# EAGLE design RHB0032E.pac (EAGLE 9.6.2)
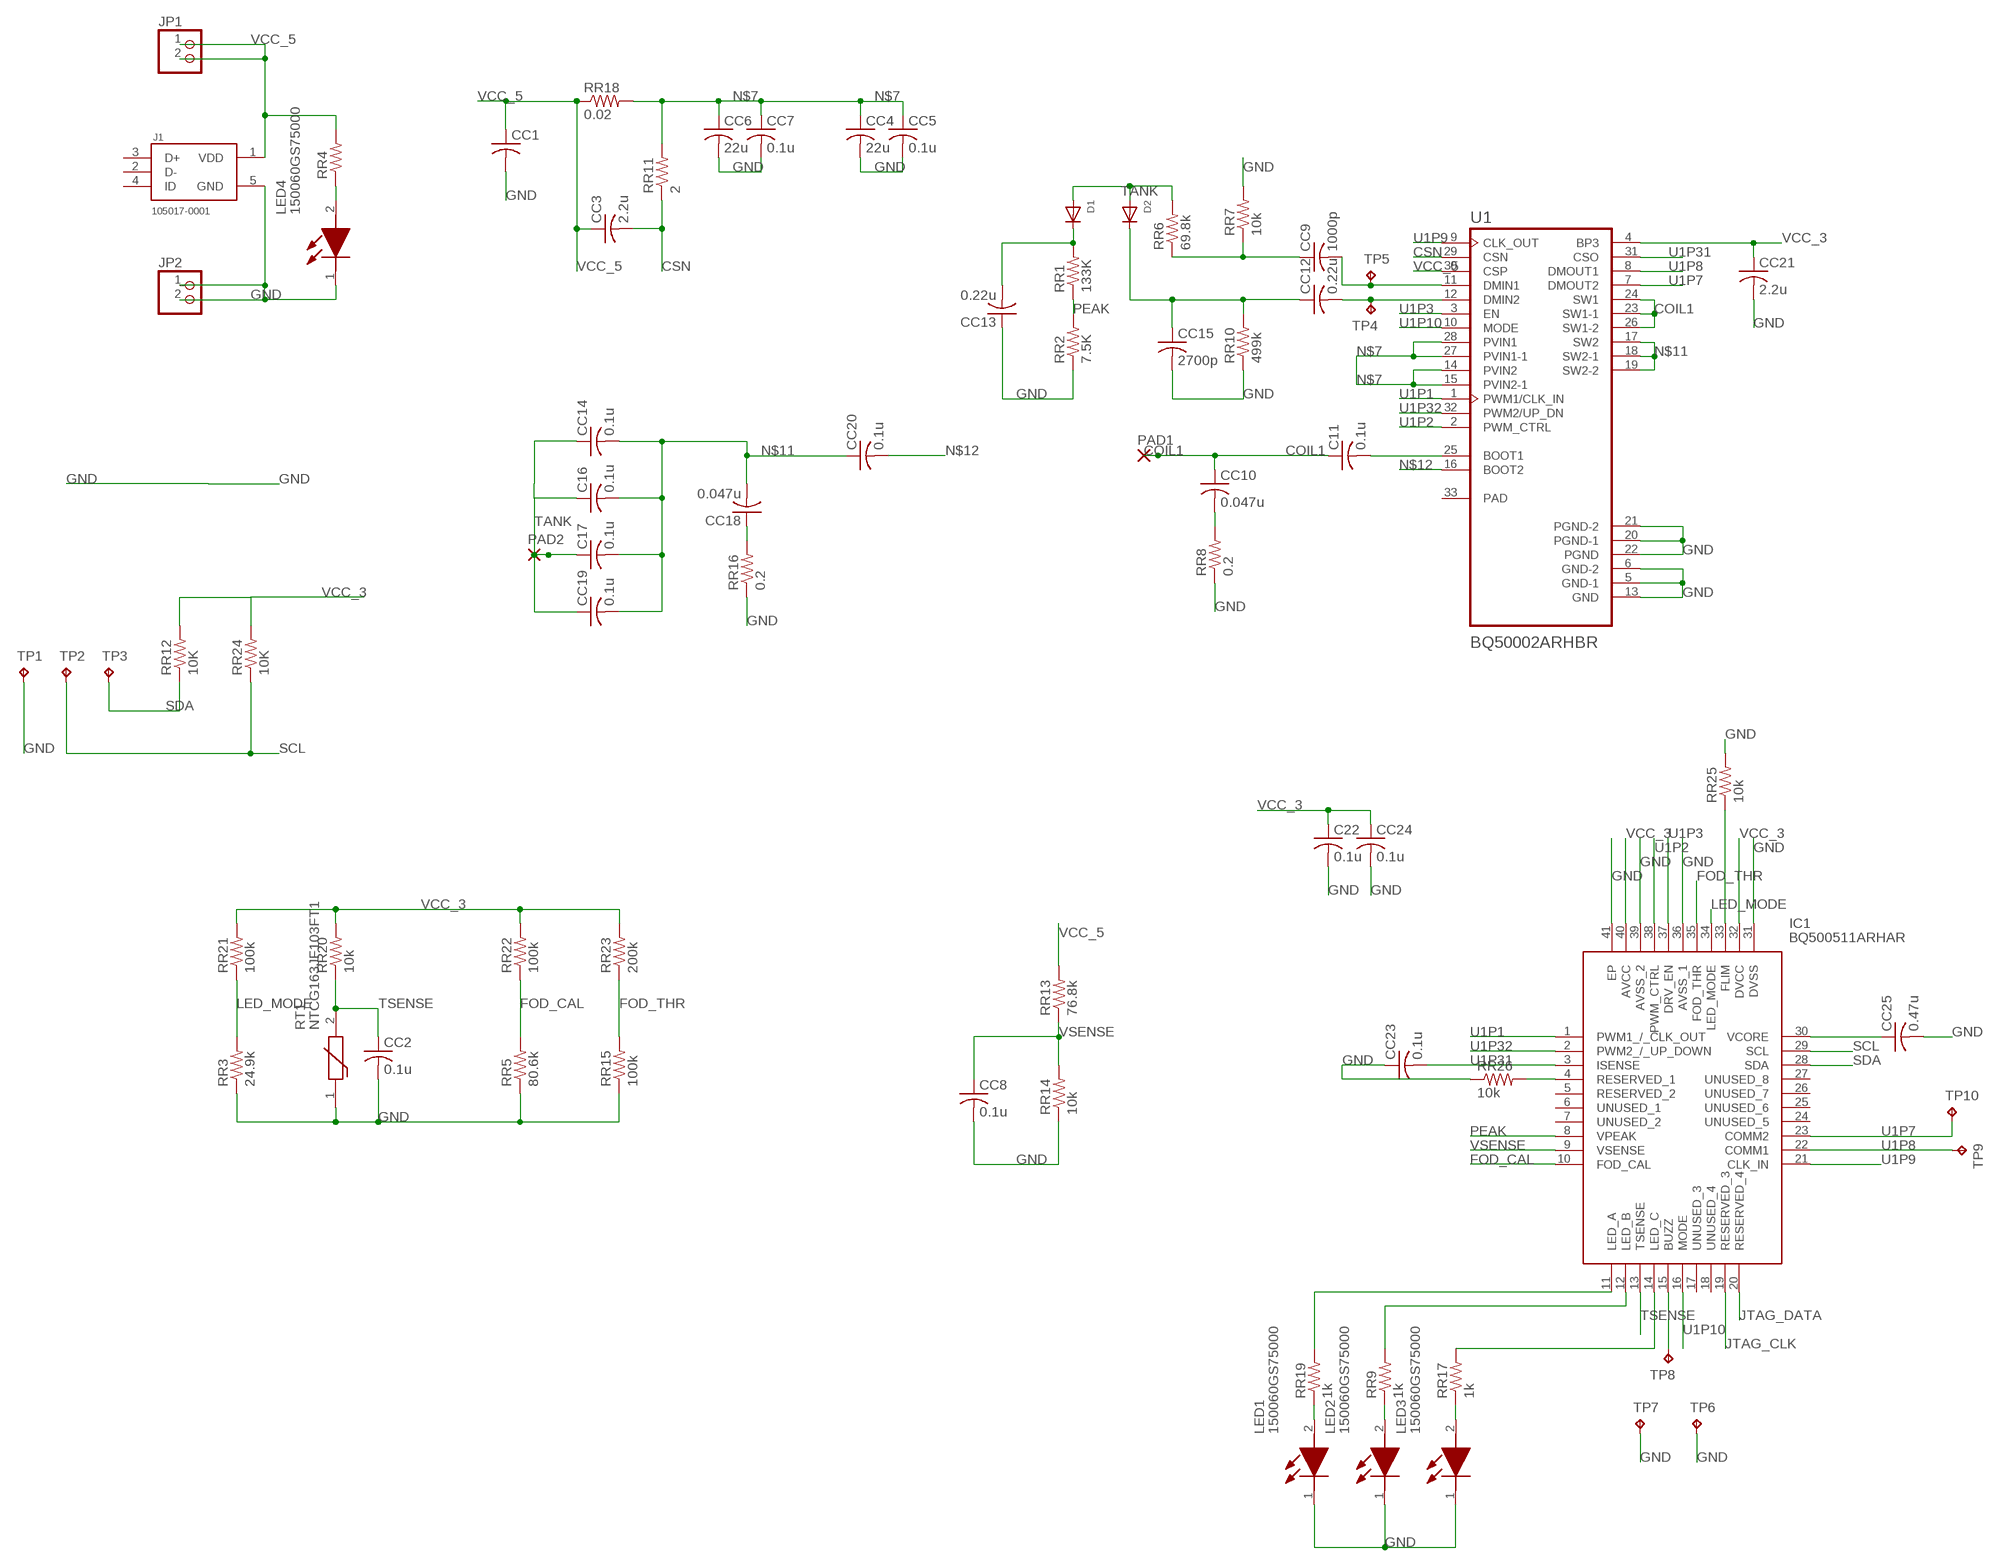
[diagram p0: schematic, sheet 1]

## Parts
C11  0.1u  C-USC0402  [C0402]
C16  0.1u  C-USC0402  [C0402]
C17  0.1u  C-USC0402  [C0402]
C22  0.1u  C-USC0402  [C0402]
CC1  C-USC0402  [C0402]
CC2  0.1u  C-USC0402  [C0402]
CC3  2.2u  C-USC0402  [C0402]
CC4  22u  C-USC0402  [C0402]
CC5  0.1u  C-USC0402  [C0402]
CC6  22u  C-USC0402  [C0402]
CC7  0.1u  C-USC0402  [C0402]
CC8  0.1u  C-USC0402  [C0402]
CC9  1000p  C-USC0402  [C0402]
CC10  0.047u  C-USC0402  [C0402]
CC12  0.22u  C-USC0402  [C0402]
CC13  0.22u  C-USC0402  [C0402]
CC14  0.1u  C-USC0402  [C0402]
CC15  2700p  C-USC0402  [C0402]
CC18  0.047u  C-USC0402  [C0402]
CC19  0.1u  C-USC0402  [C0402]
CC20  0.1u  C-USC0402  [C0402]
CC21  2.2u  C-USC0402  [C0402]
CC23  0.1u  C-USC0402  [C0402]
CC24  0.1u  C-USC0402  [C0402]
CC25  0.47u  C-USC0402  [C0402]
D1  DIODESOD-523  [SOD-523]
D2  DIODESOD-523  [SOD-523]
IC1  BQ500511ARHAR  [QFN50P600X600X100-41N]
J1  105017-0001  [MOLEX_105017-0001]
JP1  PINHD-1X2  [1X02]
JP2  PINHD-1X2  [1X02]
LED1  150060GS75000  [LEDC1608X80N]
LED2  150060GS75000  [LEDC1608X80N]
LED3  150060GS75000  [LEDC1608X80N]
LED4  150060GS75000  [LEDC1608X80N]
PAD1  SMD2  [SMD1,27-2,54]
PAD2  SMD2  [SMD1,27-2,54]
RR1  133K  R-US_R0603  [R0603]
RR2  7.5K  R-US_R0603  [R0603]
RR3  24.9k  R-US_R0603  [R0603]
RR4  R-US_R0603  [R0603]
RR5  80.6k  R-US_R0603  [R0603]
RR6  69.8k  R-US_R0603  [R0603]
RR7  10k  R-US_R0603  [R0603]
RR8  0.2  R-US_R0603  [R0603]
RR9  1k  R-US_R0603  [R0603]
RR10  499k  R-US_R0603  [R0603]
RR11  2  R-US_R0603  [R0603]
RR12  10K  R-US_R0603  [R0603]
RR13  76.8k  R-US_R0603  [R0603]
RR14  10k  R-US_R0603  [R0603]
RR15  100k  R-US_R0603  [R0603]
RR16  0.2  R-US_R0603  [R0603]
RR17  1k  R-US_R0603  [R0603]
RR18  0.02  R-US_R0603  [R0603]
RR19  1k  R-US_R0603  [R0603]
RR20  10k  R-US_R0603  [R0603]
RR21  100k  R-US_R0603  [R0603]
RR22  100k  R-US_R0603  [R0603]
RR23  200k  R-US_R0603  [R0603]
RR24  10K  R-US_R0603  [R0603]
RR25  10k  R-US_R0603  [R0603]
RR26  10k  R-US_R0603  [R0603]
RT1  NTCG163JF103FT1  [THRMC1608X90N]
TP1  TPB1,27  [B1,27]
TP2  TPB1,27  [B1,27]
TP3  TPB1,27  [B1,27]
TP4  TPB1,27  [B1,27]
TP5  TPB1,27  [B1,27]
TP6  TPB1,27  [B1,27]
TP7  TPB1,27  [B1,27]
TP8  TPB1,27  [B1,27]
TP9  TPB1,27  [B1,27]
TP10  TPB1,27  [B1,27]
U1  BQ50002ARHBR  [IC_ADS125H01IRHBT]

## Nets
COIL1: C11.1 CC10.1 PAD1.1(P) U1.23(SW1-1) U1.24(SW1) U1.26(SW1-2)
CSN: CC3.2 RR11.1 U1.29(CSN)
FOD_CAL: IC1.10(FOD_CAL) RR5.2 RR22.1
FOD_THR: IC1.35(FOD_THR) RR15.2 RR23.1
GND: C22.2 CC1.2 CC2.2 CC4.2 CC5.2 CC6.2 CC7.2 CC8.2 CC13.1 CC15.2 CC21.2 CC23.1 CC24.2 CC25.2 IC1.31(DVSS) IC1.36(AVSS_1) IC1.39(AVSS_2) IC1.41(EP) J1.5(GND) JP2.1 JP2.2 LED1.1(K) LED2.1(K) LED3.1(K) LED4.1(K) RR2.1 RR3.1 RR5.1 RR7.2 RR8.1 RR10.1 RR14.1 RR15.1 RR16.1 RR25.2 RR26.1 RT1.1 TP1.TP TP6.TP TP7.TP U1.5(GND-1) U1.6(GND-2) U1.13(GND) U1.20(PGND-1) U1.21(PGND-2) U1.22(PGND)
JTAG_CLK: IC1.19(RESERVED_3)
JTAG_DATA: IC1.20(RESERVED_4)
LED_MODE: IC1.34(LED_MODE) RR3.2 RR21.1
N$1: CC12.2 TP4.TP U1.12(DMIN2)
N$2: CC12.1 CC15.1 D2.K(C) RR10.2
N$4: CC13.2 D1.K(C) RR1.2
N$5: CC9.2 TP5.TP U1.11(DMIN1)
N$6: CC9.1 RR6.1 RR7.1
N$7: CC4.1 CC5.1 CC6.1 CC7.1 RR11.2 RR18.2 U1.14(PVIN2) U1.15(PVIN2-1) U1.27(PVIN1-1) U1.28(PVIN1)
N$8: IC1.15(BUZZ) TP8.TP
N$9: C11.2 U1.25(BOOT1)
N$10: CC10.2 RR8.2
N$11: C16.2 C17.2 CC14.2 CC18.2 CC19.2 CC20.1 U1.17(SW2) U1.18(SW2-1) U1.19(SW2-2)
N$12: CC20.2 U1.16(BOOT2)
N$13: CC25.1 IC1.30(VCORE)
N$14: LED1.2(A) RR19.1
N$15: CC18.1 RR16.2
N$16: LED2.2(A) RR9.1
N$17: LED3.2(A) RR17.1
N$18: IC1.33(FLIM) RR25.1
N$19: IC1.11(LED_A) RR19.2
N$20: IC1.12(LED_B) RR9.2
N$21: IC1.14(LED_C) RR17.2
N$22: IC1.4(RESERVED_1) RR26.2
N$23: LED4.2(A) RR4.1
PEAK: IC1.8(VPEAK) RR1.1 RR2.2
SCL: IC1.29(SCL) RR24.1 TP2.TP
SDA: IC1.28(SDA) RR12.1 TP3.TP
TANK: C16.1 C17.1 CC14.1 CC19.1 D1.A D2.A PAD2.1(P) RR6.2
TSENSE: CC2.1 IC1.13(TSENSE) RR20.1 RT1.2
U1P1: IC1.1(PWM1_/_CLK_OUT) U1.1(PWM1/CLK_IN)
U1P2: IC1.38(PWM_CTRL) U1.2(PWM_CTRL)
U1P3: IC1.37(DRV_EN) U1.3(EN)
U1P7: IC1.23(COMM2) TP10.TP U1.7(DMOUT2)
U1P8: IC1.22(COMM1) TP9.TP U1.8(DMOUT1)
U1P9: IC1.21(CLK_IN) U1.9(CLK_OUT)
U1P10: IC1.16(MODE) U1.10(MODE)
U1P31: CC23.2 IC1.3(ISENSE) U1.31(CSO)
U1P32: IC1.2(PWM2_/_UP_DOWN) U1.32(PWM2/UP_DN)
VCC_3: C22.1 CC21.1 CC24.1 IC1.32(DVCC) IC1.40(AVCC) RR12.2 RR20.2 RR21.2 RR22.2 RR23.2 RR24.2 U1.4(BP3)
VCC_5: CC1.1 CC3.1 J1.1(VDD) JP1.1 JP1.2 RR4.2 RR13.2 RR18.1 U1.30(CSP)
VSENSE: CC8.1 IC1.9(VSENSE) RR13.1 RR14.2
Unconnected: IC1.5(RESERVED_2) IC1.6(UNUSED_1) IC1.7(UNUSED_2) IC1.17(UNUSED_3) IC1.18(UNUSED_4) IC1.24(UNUSED_5) IC1.25(UNUSED_6) IC1.26(UNUSED_7) IC1.27(UNUSED_8) J1.2(D-) J1.3(D+) J1.4(ID) U1.33(PAD)

## Library data of the parts
C11 C16 C17 C22 CC1-CC10 CC12-CC15 CC18-CC21 CC23-CC25 = adafruit:C-US: CAPACITOR, American symbol
D1 D2 = adafruit:DIODE: Diode SMADIODE - SMA Surface Mount Package 20V 1A Schottky Diode Digikey: 641-1014-6-ND DO-1N4148 - Through Hole Small Current Diode SOD-123 20V 1 A (.5mV Vf) Schottky Diode - Digikey: MBRX120TPMSCT-ND SOD-323 10V 570mA (.38mV Vf, 3ns) Schottky Diode - Digikey: ZLLS410CT-ND SOD-523 30V 30mA Schottky Diode (RB751S-40TE61) - Digikey: RB751S-40TE61CT-ND SOT23-R/W - SOT23 Package (R = Solder Paste/Reflow Ovens, W = Hand-Soldering) BAT54Film 40V 300mA - Digikey: 497-7162-1-ND
IC1 = BQ500511ARHAR:BQ500511ARHAR: Wireless Charging ICs Wireless Power Transmitter Controller 40-VQFN -40 to 85 Source: Datasheet <http://www.ti.com/lit/ds/symlink/bq500511a.pdf>; DESCRIPTION: Wireless Charging ICs Wireless Power Transmitter Controller 40-VQFN -40 to 85; HEIGHT: 1mm; MANUFACTURER_NAME: Texas Instruments; MANUFACTURER_PART_NUMBER: BQ500511ARHAR; MOUSER_PART_NUMBER: 595-BQ500511ARHAR; MOUSER_PRICE-STOCK: https://www.mouser.co.uk/ProductDetail/Texas-Instruments/BQ500511ARHAR?qs=LuYMPh7GGMTHLnf6Ooavlw%3D%3D
J1 = 105017-0001:105017-0001: Check availability <https://pricing.snapeda.com/parts/105017-0001/Molex/view-part?ref=eda>; AVAILABILITY: In Stock; DESCRIPTION: USB - micro B USB 2.0 Receptacle Connector 5 Position Surface Mount, Right Angle; Through Hole; MF: Molex; MP: 105017-0001; PACKAGE: None; PRICE: None; PURCHASE-URL: https://pricing.snapeda.com/search/part/105017-0001/?ref=eda
JP1 JP2 = pinhead:PINHD-1X2: PIN HEADER
LED1-LED4 = 150060GS75000:150060GS75000: Wurth Elektronik WL-SMCW 520 nm Green LED, 1608 (0603) Clear SMD package Source: Datasheet <https://componentsearchengine.com/Datasheets/2/150060GS75000.pdf>; DESCRIPTION: Wurth Elektronik WL-SMCW 520 nm Green LED, 1608 (0603) Clear SMD package; HEIGHT: 0.8mm; MANUFACTURER_NAME: Wurth Elektronik; MANUFACTURER_PART_NUMBER: 150060GS75000; MOUSER_PART_NUMBER: 710-150060GS75000; MOUSER_PRICE-STOCK: https://www.mouser.co.uk/ProductDetail/Wurth-Elektronik/150060GS75000?qs=LlUlMxKIyB0UYkq5lDO8nA%3D%3D
PAD1 PAD2 = wirepad:SMD2: SMD PAD
RR1-RR26 = adafruit:R-US_: RESISTOR, American symbol
RT1 = NTCG163JF103FT1:NTCG163JF103FT1: Chip NTC Thermistors (Sensor), Resistance (at 25?C)=10k?, Resistance Tolerance (at 25?C)=?1% Source: Datasheet <https://product.tdk.com/system/files/dam/doc/product/sensor/ntc/chip-ntc-thermistor/catalog/tpd_commercial_ntc-thermistor_ntcg_en.pdf>; DESCRIPTION: Chip NTC Thermistors (Sensor), Resistance (at 25?C)=10k?, Resistance Tolerance (at 25?C)=?1%; HEIGHT: 0.9mm; MANUFACTURER_NAME: TDK; MANUFACTURER_PART_NUMBER: NTCG163JF103FT1; MOUSER_PART_NUMBER: 810-NTCG163JF103FT1; MOUSER_PRICE-STOCK: https://www.mouser.co.uk/ProductDetail/TDK/NTCG163JF103FT1?qs=f0gCvUGw%252BIyUP%2FT8hD9VGA%3D%3D
TP1-TP10 = testpad:TP: Test pad
U1 = BQ50002ARHBR:BQ50002ARHBR: Check availability <https://pricing.snapeda.com/parts/BQ50002ARHBR/Texas%20Instruments/view-part?ref=eda>; AVAILABILITY: In Stock; DESCRIPTION: Low-Cost 5-V Wireless Power Transmitter AFE WPC V 1.2 A11 Transmitter 32-VQFN -40 to 125; MF: Texas Instruments; MP: BQ50002ARHBR; PACKAGE: VQFN-32 Texas Instruments; PRICE: None; PURCHASE-URL: https://pricing.snapeda.com/search/part/BQ50002ARHBR/?ref=eda

## Board
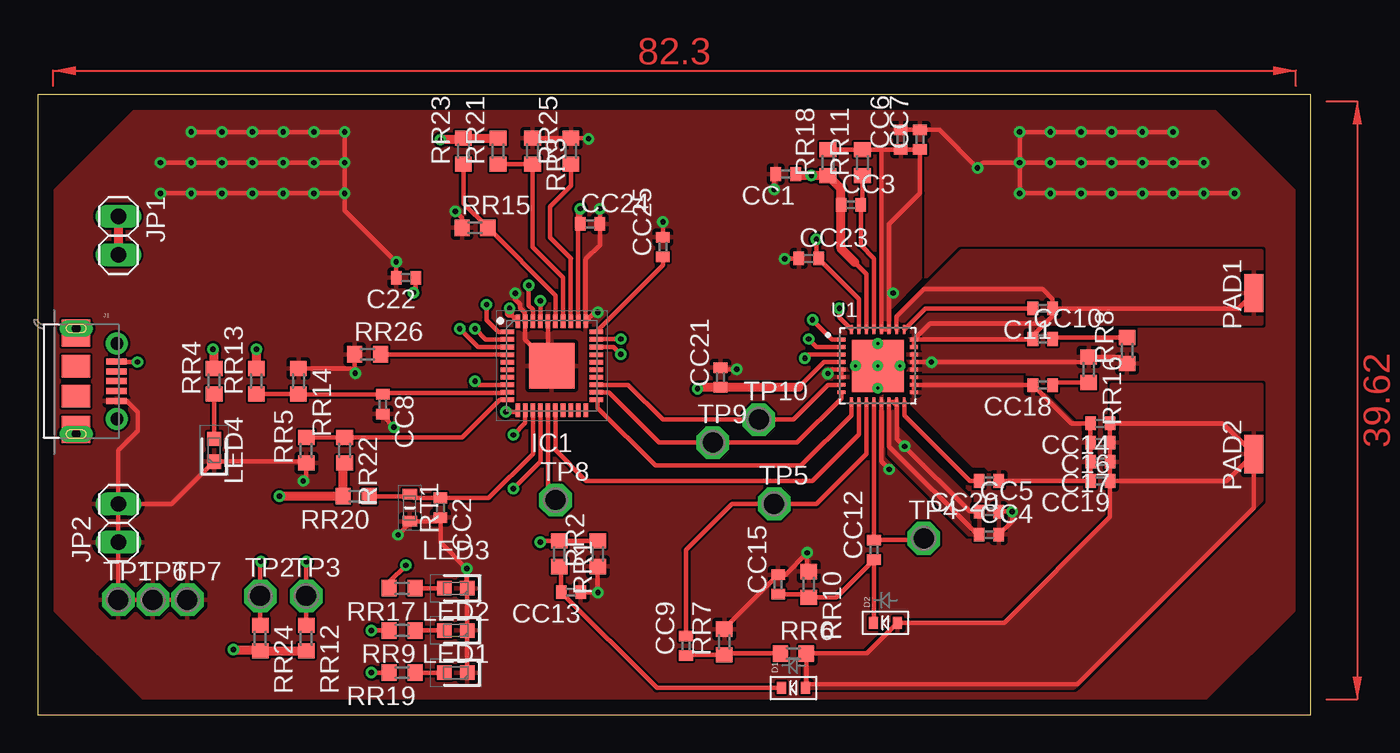
[diagram p1: board, top side]
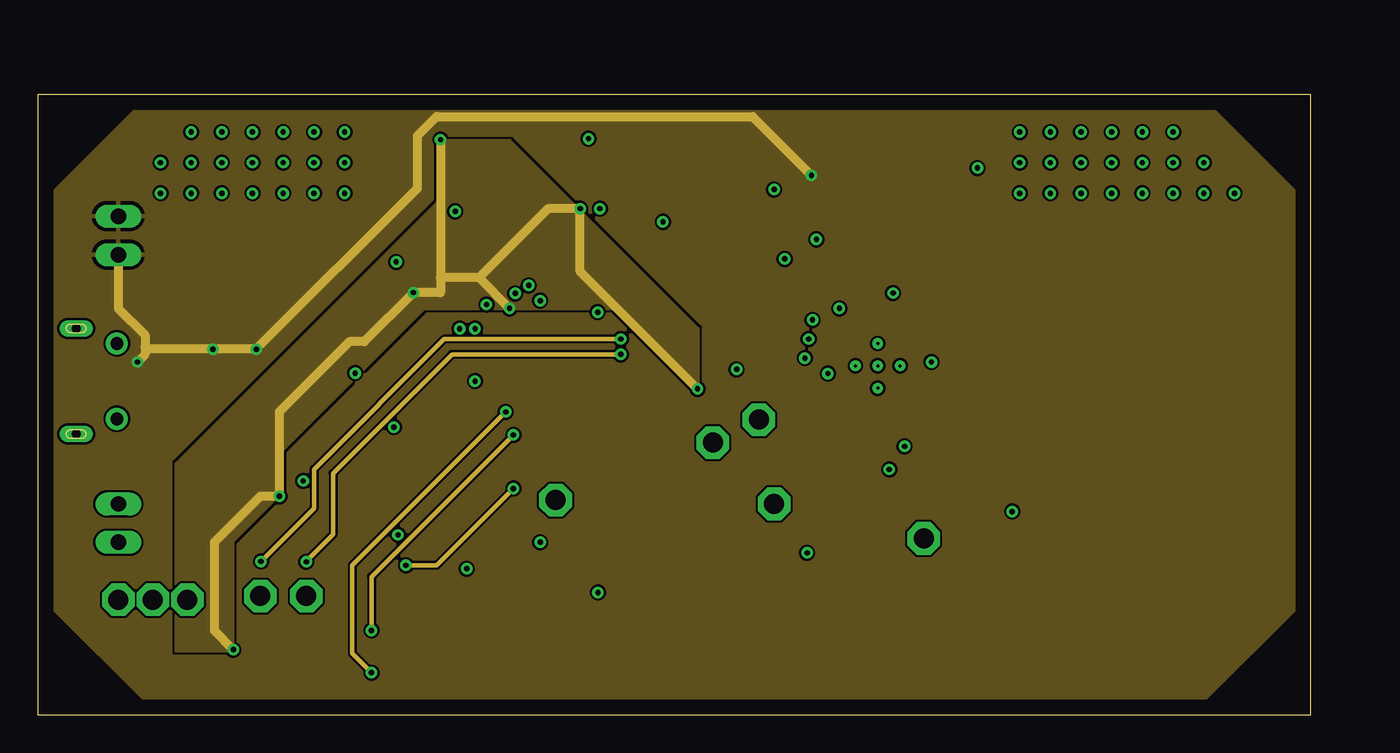
[diagram p2: board, inner layer Route2]
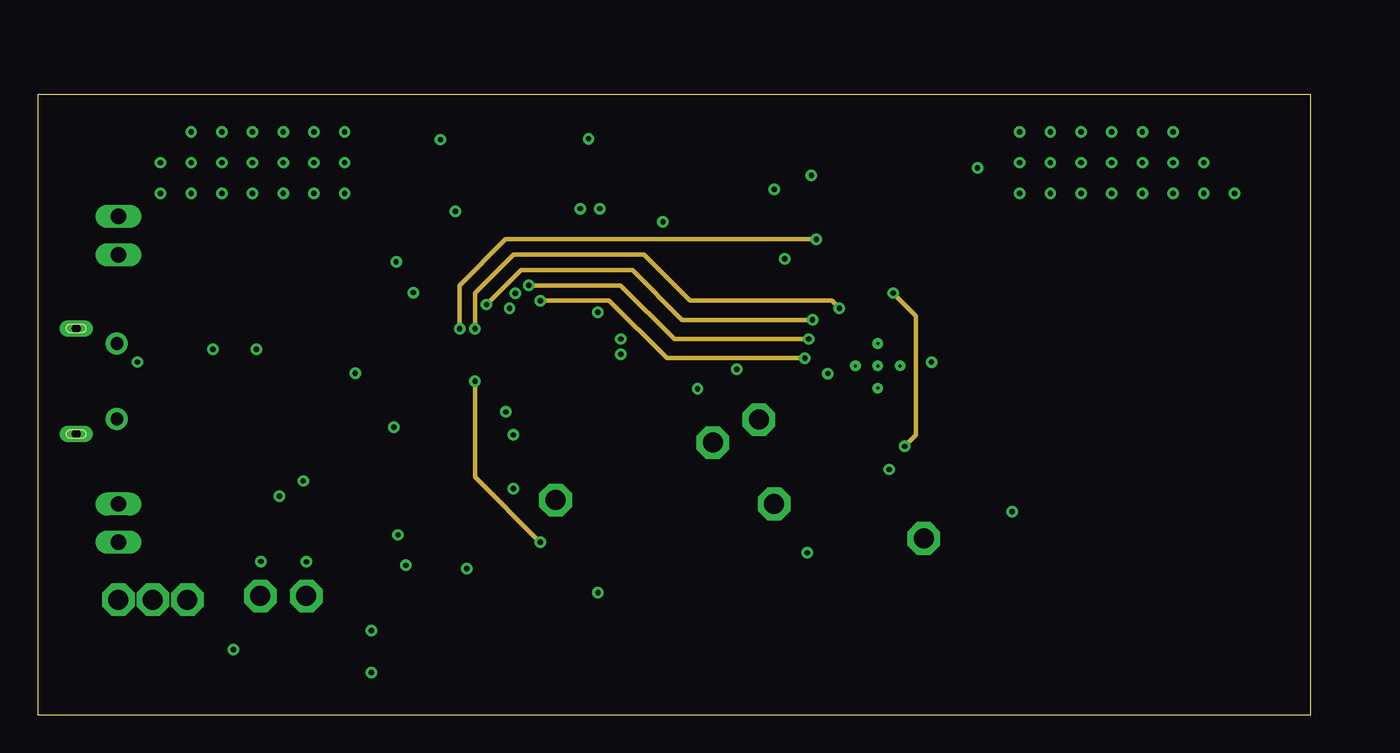
[diagram p3: board, inner layer Route15]
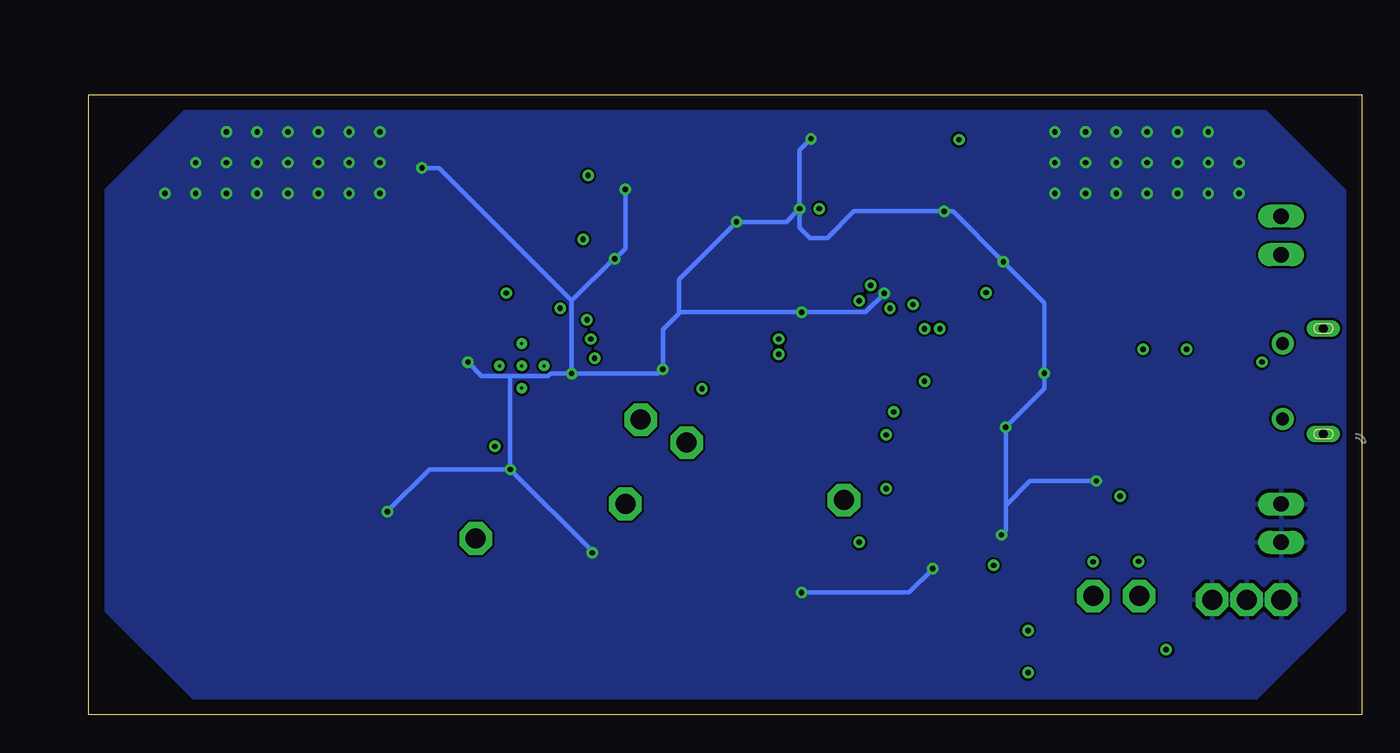
[diagram p4: board, bottom side, seen from below]

Size 84.31 x 41.07 mm. Coordinates in mm from the lower left corner, seen from the top.
Outline: 0,0 84.31,0 84.31,41.07 0,41.07 0,0
Copper layers (1+2*15+16): Top 0.035mm / dielectric 1.5mm / Route2 0.035mm / dielectric 0.15mm / Route15 0.035mm / dielectric 0.2mm / Bottom 0.035mm
Design rules "default *": minimum track width 6mil, minimum drill 0.35mm, track to track 6mil, track to pad 6mil, pad to pad 6mil, via to via 6mil, smd to smd 6mil, copper to edge 40mil, drill to drill 6mil, minimum pad ring 10mil, minimum via ring 8mil, stop-mask expansion 4mil, vias tented up to drill 0mil, thermal gap 10mil

### Footprints (pad centres in the part's own frame; a part is rotated, then mirrored left to right if it is on the bottom)
C0402 = smd 0.7 x 0.9: 1 -0.65,0; 2 0.65,0
SOD-523 = smd 0.8 x 0.6: A 0,-0.8; K 0,0.8
QFN50P600X600X100-41N = smd 0.9 x 0.3: 1 -2.95,2.25; 2 -2.95,1.75; 3 -2.95,1.25; 4 -2.95,0.75; 5 -2.95,0.25; 6 -2.95,-0.25; 7 -2.95,-0.75; 8 -2.95,-1.25; 9 -2.95,-1.75; 10 -2.95,-2.25; 21 2.95,-2.25; 22 2.95,-1.75; 23 2.95,-1.25; 24 2.95,-0.75; 25 2.95,-0.25; 26 2.95,0.25; 27 2.95,0.75; 28 2.95,1.25; 29 2.95,1.75; 30 2.95,2.25 | smd 0.3 x 0.9: 11 -2.25,-2.95; 12 -1.75,-2.95; 13 -1.25,-2.95; 14 -0.75,-2.95; 15 -0.25,-2.95; 16 0.25,-2.95; 17 0.75,-2.95; 18 1.25,-2.95; 19 1.75,-2.95; 20 2.25,-2.95; 31 2.25,2.95; 32 1.75,2.95; 33 1.25,2.95; 34 0.75,2.95; 35 0.25,2.95; 36 -0.25,2.95; 37 -0.75,2.95; 38 -1.25,2.95; 39 -1.75,2.95; 40 -2.25,2.95 | smd 3 x 3: 41 0,0
MOLEX_105017-0001 = smd 0.4 x 1.35: 1 -1.3,2.675; 2 -0.65,2.675; 3 0,2.675; 4 0.65,2.675; 5 1.3,2.675 | drill 0.85 pad 1.45: P$1 -2.5,2.7; P$2 2.5,2.7 | smd 1.5 x 1.9: P$8 -1,0; P$9 1,0 | smd 1.8 x 1.9: P$10 -3.2,0; P$11 3.2,0 | drill 0.6 pad 0.8 long: P$12 -3.5,0; P$13 3.5,0
1X02 = drill 1.016 long: 1 -1.27,0; 2 1.27,0
LEDC1608X80N = smd 0.95 x 0.95: 1 -0.75,0; 2 0.75,0
SMD1,27-2,54 = smd 1.27 x 2.54: 1 0,0
R0603 = smd 1 x 1.1: 1 -0.85,0; 2 0.85,0
THRMC1608X90N = smd 0.7 x 0.95: 1 -0.9,0; 2 0.9,0
P1-13 = drill 1.321 pad 2.159 octagon: TP 0,0
IC_ADS125H01IRHBT = smd 0.6 x 0.25: 1 -2.4,1.75; 2 -2.4,1.25; 3 -2.4,0.75; 4 -2.4,0.25; 5 -2.4,-0.25; 6 -2.4,-0.75; 7 -2.4,-1.25; 8 -2.4,-1.75; 17 2.4,-1.75; 18 2.4,-1.25; 19 2.4,-0.75; 20 2.4,-0.25; 21 2.4,0.25; 22 2.4,0.75; 23 2.4,1.25; 24 2.4,1.75 | smd 0.25 x 0.6: 9 -1.75,-2.4; 10 -1.25,-2.4; 11 -0.75,-2.4; 12 -0.25,-2.4; 13 0.25,-2.4; 14 0.75,-2.4; 15 1.25,-2.4; 16 1.75,-2.4; 25 1.75,2.4; 26 1.25,2.4; 27 0.75,2.4; 28 0.25,2.4; 29 -0.25,2.4; 30 -0.75,2.4; 31 -1.25,2.4; 32 -1.75,2.4 | smd 3.45 x 3.45: 33 0,0 | drill 0.2 pad 0.4: 34 0,0; 35 0,1.475; 36 -1.475,0; 37 0,-1.475; 38 1.475,0

### Placement (x,y rotation side)
C11  66.55,26.92 180 top
C16  70.36,18.03 180 top
C17  70.36,16.76 180 top
C22  24.38,28.96 180 top
CC1  49.53,35.81 180 top
CC2  26.67,13.72 270 top
CC3  53.85,33.78 0 top
CC4  62.99,11.94 0 top
CC5  62.99,13.46 0 top
CC6  57.15,38.1 90 top
CC7  58.42,38.1 90 top
CC8  22.86,20.57 270 top
CC9  42.93,4.57 90 top
CC10  66.55,24.89 0 top
CC12  55.37,10.92 90 top
CC13  35.31,8.13 180 top
CC14  70.36,19.3 180 top
CC15  49.02,8.64 90 top
CC18  66.55,21.84 180 top
CC19  70.36,15.49 180 top
CC20  62.99,15.49 180 top
CC21  45.21,22.35 90 top
CC23  51.05,30.23 0 top
CC24  36.58,32.51 0 top
CC25  41.4,30.99 90 top
D1  50.04,1.78 90 top
D2  56.13,6.1 90 top
IC1  34.04,23.11 0 top
J1  2.54,22.1 270 top
JP1  5.33,31.75 270 top
JP2  5.33,12.7 90 top
LED1  27.69,2.79 180 top
LED2  27.69,5.59 180 top
LED3  27.69,8.38 180 top
LED4  11.68,17.53 90 top
PAD1  80.52,27.94 0 top
PAD2  80.52,17.27 0 top
RR1  34.54,10.67 270 top
RR2  37.08,10.67 90 top
RR3  32.77,37.34 270 top
RR4  11.68,22.1 90 top
RR5  17.78,17.53 90 top
RR6  50.04,4.06 0 top
RR7  45.47,4.83 90 top
RR8  72.14,24.13 90 top
RR9  24.13,5.59 180 top
RR10  51.05,8.64 270 top
RR11  54.61,36.58 90 top
RR12  17.78,5.08 270 top
RR13  14.48,22.1 90 top
RR14  17.27,22.1 270 top
RR15  28.96,32.26 0 top
RR16  69.6,22.86 270 top
RR17  24.13,8.38 180 top
RR18  52.32,36.58 90 top
RR19  24.13,2.79 180 top
RR20  21.08,14.48 180 top
RR21  30.48,37.34 90 top
RR22  20.32,17.53 270 top
RR23  28.19,37.34 90 top
RR24  14.73,5.08 270 top
RR25  35.31,37.34 90 top
RR26  21.84,23.88 0 top
RT1  24.64,13.72 90 top
TP1  TPPAD1-13  [P1-13]  5.33,7.62 0 top
TP2  TPPAD1-13  [P1-13]  14.73,7.87 0 top
TP3  TPPAD1-13  [P1-13]  17.78,7.87 0 top
TP4  TPPAD1-13  [P1-13]  58.67,11.68 0 top
TP5  TPPAD1-13  [P1-13]  48.77,13.97 0 top
TP6  TPPAD1-13  [P1-13]  7.62,7.62 0 top
TP7  TPPAD1-13  [P1-13]  9.91,7.62 0 top
TP8  TPPAD1-13  [P1-13]  34.29,14.22 0 top
TP9  TPPAD1-13  [P1-13]  44.7,18.03 0 top
TP10  TPPAD1-13  [P1-13]  47.75,19.56 0 top
U1  55.63,23.11 0 top

### Tracks (layer width: path | path; a pad name or v marks a point on that pad's centre or on a via)
COIL1
  Top 0.305: U1.23 U1.24 | U1.24 65.87,24.86 CC10.1 65.9,25.12 66.69,25.91 | U1.24 59.07,25.91 66.69,25.91 | C11.1 67.2,26.42 66.69,25.91 | U1.26 56.88,26.4 58.67,28.19 66.55,28.19 67.2,27.54 C11.1 | PAD1.1 79.5,26.92 C11.1
  pour Top: 56.9,25.4 56.9,26.42 61.21,30.73 81.03,30.73 81.03,25.91 66.8,25.91 65.79,24.89 57.91,24.89 57.4,25.4
CSN
  Top 0.305: U1.29 55.38,30.22 54.5,31.1 CC3.2 54.61,33.89 RR11.1
FOD_CAL
  Top 0.305: IC1.10 30.58,20.86 28.09,18.38 RR22.1 RR5.2
FOD_THR
  Top 0.305: RR23.1 28.19,33.87 RR15.2 34.29,27.78 IC1.35
GND  (via drill 0.35)
  Top 0.305: U1.22 U1.21 | U1.21 U1.20 | RR8.1 71.71,23.71 RR16.1 69.25,23.36 v59.18,23.36 U1.21 | CC6.2 CC7.2 59.7,38.75 v62.23,36.22 62.59,36.58 v65.02,36.58 | CC4.2 64.53,12.83 v64.53,13.46 CC5.2 | RR7.2 45.47,5.73 CC15.2 49.51,9.29 v50.95,10.73 50.95,9.59 RR10.1 | RR2.1 37.08,8.12 | 37.08,8.12 v37.1,8.1 | JP2.2 JP2.1 TP1.TP TP6.TP TP7.TP | JP2.2 5.33,17.53 6.6,18.8 6.6,20.07 5.84,20.83 5.25,20.83 J1.5 | RR14.1 20.7,22.95 v21.02,22.63 20.99,22.66 RR26.1 | U1.6 U1.5 52.58,22.86 v52.32,22.61 | v46.28,22.89 45.33,22.89 CC21.2 | CC25.2 v41.4,32.65 | v48.77,34.8 48.77,35.7 CC1.2 | v23.86,11.92 24.64,12.7 RT1.1 26.42,12.82 CC2.2 26.67,11.42 v28.41,9.68 28.41,8.41 LED3.1 LED2.1 LED1.1 | v23.58,19.06 22.86,19.78 CC8.2 | v17.58,15.49 17.78,15.7 RR5.1 17.68,16.78 LED4.1 8.88,13.97 JP2.2 | U1.13 55.88,16.77 v56.39,16.26 | v37.08,26.67 36.89,26.67 IC1.31 36.29,30.19 37.23,31.13 CC24.2 v37.23,33.53 | C22.2 v23.73,30 20.32,33.41 v20.32,34.54 | IC1.36 33.79,23.36 IC1.41 32.29,24.86 IC1.39 32.24,26.11 32.24,26.64 31.93,26.96 31.93,27.21 31.62,27.51 v31.62,27.91 | v49.46,30.2 49.49,30.23 CC23.1 | v36.47,38.16 36.45,38.19 RR25.2 RR3.1 | v27.65,33.35 28.11,32.89 RR15.1 | CC13.1 37.08,8.12 | v20.32,34.54 v20.32,36.58 | v20.32,36.58 v20.32,38.61 v18.29,38.61 v16.26,38.61 v14.22,38.61 v12.19,38.61 v10.16,38.61 | v20.32,36.58 v18.29,36.58 v16.26,36.58 v14.22,36.58 v12.19,36.58 v10.16,36.58 v8.13,36.58 | v8.13,34.54 v10.16,34.54 v12.19,34.54 v14.22,34.54 v16.26,34.54 v18.29,34.54 v20.32,34.54 | v65.02,36.58 v65.02,38.61 v67.06,38.61 v69.09,38.61 v71.12,38.61 v73.15,38.61 v75.18,38.61 | v77.22,36.58 v75.18,36.58 v73.15,36.58 v71.12,36.58 v69.09,36.58 v67.06,36.58 v65.02,36.58
  Top 0.305: v65.02,36.58 v65.02,34.54 v67.06,34.54 v69.09,34.54 v71.12,34.54 v73.15,34.54 v75.18,34.54 v77.22,34.54 v79.25,34.54
  Bottom 0.305: v52.32,22.61 52.32,27.43 | v62.23,36.22 61.11,36.22 52.32,27.43 | v52.32,22.61 46.56,22.61 v46.28,22.89 46.28,25.53 45.21,26.59 | 45.21,26.59 45.21,28.84 v41.4,32.65 38.1,32.65 v37.23,33.53 | 52.32,27.43 49.55,30.2 v49.46,30.2 48.77,30.9 v48.77,34.8 | v23.86,11.92 23.58,12.2 23.58,13.87 | 23.58,13.87 v23.58,19.06 21.02,21.62 v21.02,22.63 21.02,27.28 v23.73,30 27.09,33.35 v27.65,33.35 33.61,33.35 35.39,31.58 36.54,31.58 37.23,32.26 v37.23,33.53 | v17.58,15.49 21.96,15.49 23.58,13.87 | v36.47,38.16 37.23,37.41 v37.23,33.53 | v52.32,22.61 53.73,22.61 53.88,22.46 56.39,22.46 | v59.18,23.36 58.27,22.46 56.39,22.46 | v56.39,16.26 56.39,22.46 | v37.1,8.1 29.99,8.1 v28.41,9.68 | v56.39,16.26 50.95,10.82 v50.95,10.73 | v56.39,16.26 61.74,16.26 v64.53,13.46 | 45.21,26.59 45.14,26.67 v37.08,26.67 32.87,26.67 v31.62,27.91
  pour Top: 57.91,23.88 68.83,23.88 69.09,24.13 81.03,24.13 81.03,22.86 57.91,22.86
  pour Top (rank 3): 0.76,34.29 7.11,40.64 77.22,40.64 83.57,34.29 83.57,7.37 76.96,0.76 7.37,0.76 0.76,7.37
  pour Bottom: 7.11,40.64 0.76,34.29 0.76,7.37 7.37,0.76 76.96,0.76 83.57,7.37 83.57,34.29 77.22,40.64
LED_MODE
  Top 0.305: RR21.1 RR3.2 32.77,30.99 34.79,28.97 IC1.34
N$1
  Top 0.305: TP4.TP 58.56,11.57 CC12.2 U1.12
N$2
  Top 0.305: CC15.1 50.85,7.99 RR10.2 52.89,7.79 CC12.1 55.37,6.13 D2.K
N$4
  Top 0.305: D1.K 41.01,1.78 CC13.2 34.66,9.71 RR1.2
N$5
  Top 0.305: U1.11 54.88,17.28 51.56,13.97 TP5.TP 45.97,13.97 42.93,10.92 CC9.2
N$6
  Top 0.305: RR6.1 45.55,4.06 RR7.1 42.98,3.98 CC9.1
N$7  (via drill 0.35)
  Top 0.305: U1.27 U1.28 55.88,37.43 | RR18.2 RR11.2 55.88,37.43 | 55.88,37.43 55.9,37.45 CC6.1 CC7.1 58.42,34.54 56.38,32.5 U1.27 | 56.64,20.71 U1.14 56.38,17.79 62.23,11.94 CC4.1 | 56.64,20.71 U1.15 | 56.64,20.71 56.9,20.46 56.9,18.29 v57.4,17.78 61.72,13.46 CC5.1 | U1.27 56.38,27.67 v56.64,27.94
  Route15 0.305: v56.64,27.94 58.17,26.42 58.17,18.54 v57.4,17.78
  pour Top: 56.39,20.83 56.9,20.83 56.9,19.05 62.48,13.46 62.48,11.68 61.98,11.68 56.39,17.27
  pour Top: 55.88,25.4 56.39,25.4 56.39,26.92 58.42,28.96 58.42,37.34 55.88,37.34
N$8
  Top 0.305: TP8.TP 33.79,14.73 IC1.15
N$9
  Top 0.305: C11.2 58.79,26.92 U1.25
N$10
  Top 0.305: CC10.2 67.29,24.98 RR8.2
N$11
  Top 0.305: U1.17 U1.18 | U1.19 U1.18 | U1.18 58.05,21.84 CC18.2 68.44,19.3 CC14.2 C16.2 C17.2 CC19.2 CC20.1
  pour Top: 57.91,22.35 65.53,22.35 68.58,19.3 69.85,19.3 69.85,15.49 63.75,15.49 62.74,16.51 61.98,16.51 57.91,20.57
N$12
  Top 0.305: U1.16 57.38,19.84 61.72,15.49 CC20.2
N$13
  Top 0.305: IC1.30 41.4,29.78 CC25.1
N$14
  Top 0.305: RR19.1 LED1.2
N$15
  Top 0.305: CC18.1 67.36,22.01 RR16.2
N$16
  Top 0.305: LED2.2 RR9.1
N$17
  Top 0.305: RR17.1 LED3.2
N$18
  Top 0.305: IC1.33 35.29,30.21 35.31,30.23 33.91,31.62 33.91,33.66 35.31,35.05 RR25.1
N$19  (via drill 0.35)
  Top 0.305: IC1.11 31.69,20.07 v30.99,20.07 | v22.1,2.79 RR19.2
  Route2 0.305: v30.99,20.07 20.83,9.91 20.83,4.06 v22.1,2.79
N$20  (via drill 0.35)
  Top 0.305: IC1.12 32.29,19.33 v31.5,18.54 | v22.1,5.59 RR9.2
  Route2 0.305: v31.5,18.54 22.1,9.14 v22.1,5.59
N$21  (via drill 0.35)
  Top 0.305: IC1.14 33.29,16.78 v31.5,14.99 | v24.38,9.91 23.28,8.8 RR17.2
  Route2 0.305: v31.5,14.99 26.42,9.91 v24.38,9.91
N$22
  Top 0.305: IC1.4 RR26.2
N$23
  Top 0.305: RR4.1 LED4.2
PEAK  (via drill 0.35)
  Top 0.305: RR2.2 RR1.1 33.36,11.52 v33.27,11.43 | IC1.8 29.19,21.86 v28.96,22.1
  Route15 0.305: v28.96,22.1 28.96,15.75 v33.27,11.43
SCL  (via drill 0.35)
  Top 0.305: IC1.29 37.01,24.89 v38.61,24.89 | v14.78,10.16 14.73,10.11 TP2.TP RR24.1
  Route2 0.305: v38.61,24.89 26.92,24.89 18.29,16.26 18.29,13.67 v14.78,10.16
SDA  (via drill 0.35)
  Top 0.305: IC1.28 38.12,24.36 v38.61,23.88 | RR12.1 TP3.TP v17.78,10.14
  Route2 0.305: v38.61,23.88 27.43,23.88 19.56,16 19.56,11.94 17.78,10.16 v17.78,10.14
TANK
  Top 0.305: CC19.1 C17.1 C16.1 CC14.1 78.49,19.3 PAD2.1 | CC19.1 78.74,15.49 PAD2.1 | CC19.1 71.01,13.1 64.01,6.1 D2.A 54.9,4.06 RR6.2 50.89,1.83 D1.A 51.09,2.03 68.83,2.03 80.52,13.72 PAD2.1
  pour Top: 71.12,19.3 71.12,21.84 81.03,21.84 81.03,16 81.03,14.22 80.26,13.46 68.83,2.03 68.58,1.78 50.8,1.78 50.8,4.06 54.86,4.06 56.9,6.1 64.01,6.1 71.12,13.21
TSENSE
  Top 0.305: IC1.13 32.79,17.29 29.86,14.37 CC2.1 24.89,14.37 RT1.2 24.5,14.48 RR20.1
U1P1  (via drill 0.35)
  Top 0.305: U1.1 52.61,24.86 v51.31,26.16 | v29.72,27.18 29.72,26.16 30.52,25.36 IC1.1
  Route15 0.305: v51.31,26.16 42.67,26.16 39.37,29.46 32,29.46 v29.72,27.18
U1P2  (via drill 0.35)
  Top 0.305: U1.2 51.58,24.36 v51.05,24.89 | IC1.38 32.79,26.84 32.51,27.12 v32.51,28.45
  Route15 0.305: v51.05,24.89 42.16,24.89 38.61,28.45 v32.51,28.45
U1P3  (via drill 0.35)
  Top 0.305: U1.3 51.04,23.86 v50.8,23.62 | v33.27,27.43 33.29,27.42 IC1.37
  Route15 0.305: v50.8,23.62 41.66,23.62 37.85,27.43 v33.27,27.43
U1P7
  Top 0.305: IC1.23 39.1,21.86 41.4,19.56 TP10.TP 50.04,19.56 52.34,21.86 U1.7
U1P8
  Top 0.305: IC1.22 37.82,21.36 41.15,18.03 TP9.TP 50.29,18.03 53.23,20.97 U1.8
U1P9
  Top 0.305: IC1.21 37.08,20.77 37.08,20.32 40.89,16.51 50.55,16.51 53.88,19.84 U1.9
U1P10
  Top 0.305: U1.10 54.38,18.56 51.31,15.49 36.32,15.49 34.29,17.53 IC1.16
U1P31  (via drill 0.35)
  Top 0.305: U1.31 54.38,27.55 CC23.2 51.56,30.37 v51.56,31.5 | v27.94,25.58 29.15,24.36 IC1.3
  Route15 0.305: v27.94,25.58 27.94,28.45 30.99,31.5 v51.56,31.5
U1P32  (via drill 0.35)
  Top 0.305: U1.32 53.09,26.3 v53.09,26.92 | v28.96,25.58 29.67,24.86 IC1.2
  Route15 0.305: v53.09,26.92 52.58,27.43 43.18,27.43 40.13,30.48 31.5,30.48 28.96,27.94 v28.96,25.58
VCC_3  (via drill 0.35)
  Top 0.305: 20.23,16.59 RR22.2 | IC1.32 35.79,33.39 v35.93,33.53 CC24.1 | U1.4 52.07,23.36 50.4,21.7 | 31.24,26.61 IC1.40 | C22.1 25.03,28.12 v24.88,27.96
  Top 0.61: 20.23,16.59 RR20.2 v16,14.48 | RR21.2 RR23.2 28.11,38.1 v26.67,38.1 | v12.95,4.32 14.64,4.32 RR24.2 RR12.2 | v43.69,21.59 43.8,21.7 CC21.1 50.4,21.7 | v31.24,26.92 31.24,26.61
  Route2 0.61: v12.95,4.32 11.68,5.59 11.68,11.43 14.73,14.48 v16,14.48 16,20.07 20.65,24.71 21.63,24.71 v24.88,27.96 26.67,27.96 26.67,28.96 | v43.69,21.59 35.93,29.35 v35.93,33.53 33.78,33.53 29.21,28.96 | v31.24,26.92 29.21,28.96 | 29.21,28.96 26.67,28.96 | v26.67,38.1 26.67,28.96
  pour Route2: 26.64,38.07 31.27,38.07 35.92,33.43 43.74,25.6 43.74,21.56 38.43,26.87 31.24,26.87 25.6,26.87 16.05,17.32 16.05,14.55 16.03,14.53 12.95,11.46 12.95,4.17 12.9,4.22 9.14,4.22 9.14,16.64 26.72,34.21 26.72,38
VCC_5  (via drill 0.35)
  Top 0.305: U1.30 54.86,25.53 54.86,29.21 54.1,29.97 | v6.6,23.37 5.25,23.37 J1.1
  Top 0.61: CC1.1 50.27,35.73 v51.23,35.73 RR18.1 53.2,34.85 CC3.1 53.2,30.88 54.1,29.97 | v14.48,24.22 RR13.2 | JP1.1 JP1.2 | RR4.2 11.68,24.14 v11.61,24.22
  Route2 0.61: JP1.2 5.33,26.92 7.11,25.15 7.11,24.36 | v51.23,35.73 47.33,39.62 26.42,39.62 25.15,38.35 25.15,34.89 v14.48,24.22 v11.61,24.22 7.25,24.22 7.11,24.36 | 7.11,24.36 7.11,23.88 v6.6,23.37
  other vias: 5.33,30.48 5.33,33.02
  pour Route2 (rank 3): 0.76,34.29 7.11,40.64 77.22,40.64 83.57,34.29 83.57,7.37 76.96,0.76 7.37,0.76 0.76,7.37
VSENSE
  Top 0.305: IC1.9 31.04,21.32 22.96,21.32 CC8.1 17.3,21.22 RR14.2 RR13.1
(copper drawn outside any net)
  shapes: Top area x2